# Altium schematic sheet Sheet1.SchDoc
size A3; SheetNumber: 3; SheetTotal: 3
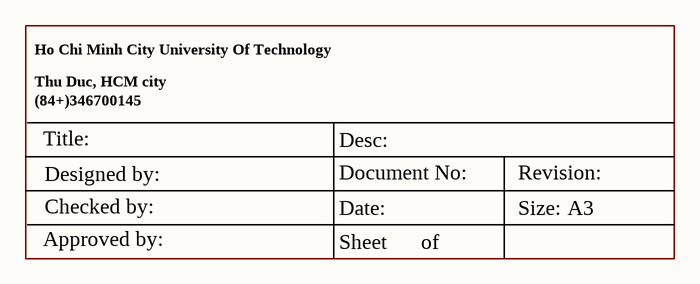
[diagram p0: Sheet1.SchDoc]

## Notes on the sheet
- Ho Chi Minh City University Of Technology
- Thu Duc, HCM city
- (84+)346700145
- Title:
- Desc:
- Designed by:
- Checked by:
- Date:
- Document No:
- Revision:
- Size:
- A3
- Approved by:
- Sheet
- of